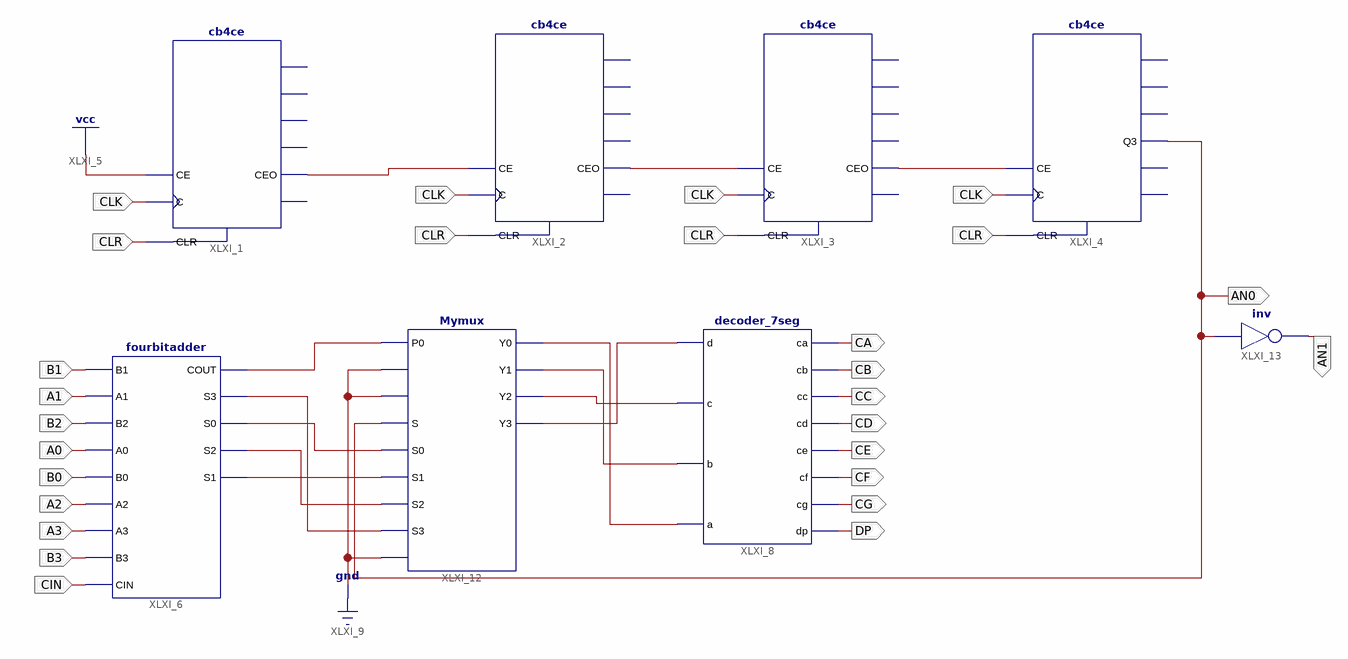
[diagram p0: schematic sheet 1]
// Xilinx ISE schematic Clck.sch (spartan3e) as structural Verilog: 8 symbols, 21 ports
module Clck (
  input  CLR,
  input  CLK,
  input  B1,
  input  A1,
  input  B2,
  input  A0,
  input  B0,
  input  A2,
  input  A3,
  input  B3,
  input  CIN,
  output CA,
  output CB,
  output CC,
  output CD,
  output CE,
  output CF,
  output CG,
  output DP,
  output AN0,
  output AN1
);

  wire XLXN_2, XLXN_3, XLXN_4, XLXN_28, XLXN_29, XLXN_30, XLXN_31, XLXN_32, XLXN_33, XLXN_34, XLXN_35,
       XLXN_36;

  cb4ce XLXI_1 (.C(CLK), .CE(1'b1), .CLR(CLR), .CEO(XLXN_2));  // open: Q0, Q1, Q2, Q3, TC
  cb4ce XLXI_2 (.C(CLK), .CE(XLXN_2), .CLR(CLR), .CEO(XLXN_3));  // open: Q0, Q1, Q2, Q3, TC
  cb4ce XLXI_3 (.C(CLK), .CE(XLXN_3), .CLR(CLR), .CEO(XLXN_4));  // open: Q0, Q1, Q2, Q3, TC
  cb4ce XLXI_4 (.C(CLK), .CE(XLXN_4), .CLR(CLR), .Q3(AN0));  // open: CEO, Q0, Q1, Q2, TC
  fourbitadder XLXI_6 (
    .B1(B1), .A1(A1), .B2(B2), .A0(A0), .B0(B0), .A2(A2), .A3(A3), .B3(B3), .CIN(CIN), .COUT(XLXN_36),
    .S3(XLXN_34), .S0(XLXN_33), .S2(XLXN_35), .S1(XLXN_32));
  decoder_7seg XLXI_8 (
    .d(XLXN_31), .c(XLXN_30), .b(XLXN_29), .a(XLXN_28), .ca(CA), .cb(CB), .cc(CC), .cd(CD), .ce(CE), .cf(CF),
    .cg(CG), .dp(DP));
  Mymux XLXI_12 (
    .S0(XLXN_33), .P0(XLXN_36), .S(AN0), .S1(XLXN_32), .S2(XLXN_35), .P2(1'b0), .S3(XLXN_34), .P3(1'b0),
    .P1(1'b0), .Y0(XLXN_28), .Y1(XLXN_29), .Y3(XLXN_31), .Y2(XLXN_30));
  not XLXI_13 (AN1, AN0);
endmodule
